# Altium schematic sheet M66_GPRS.SchDoc
size 420 x 297 mm
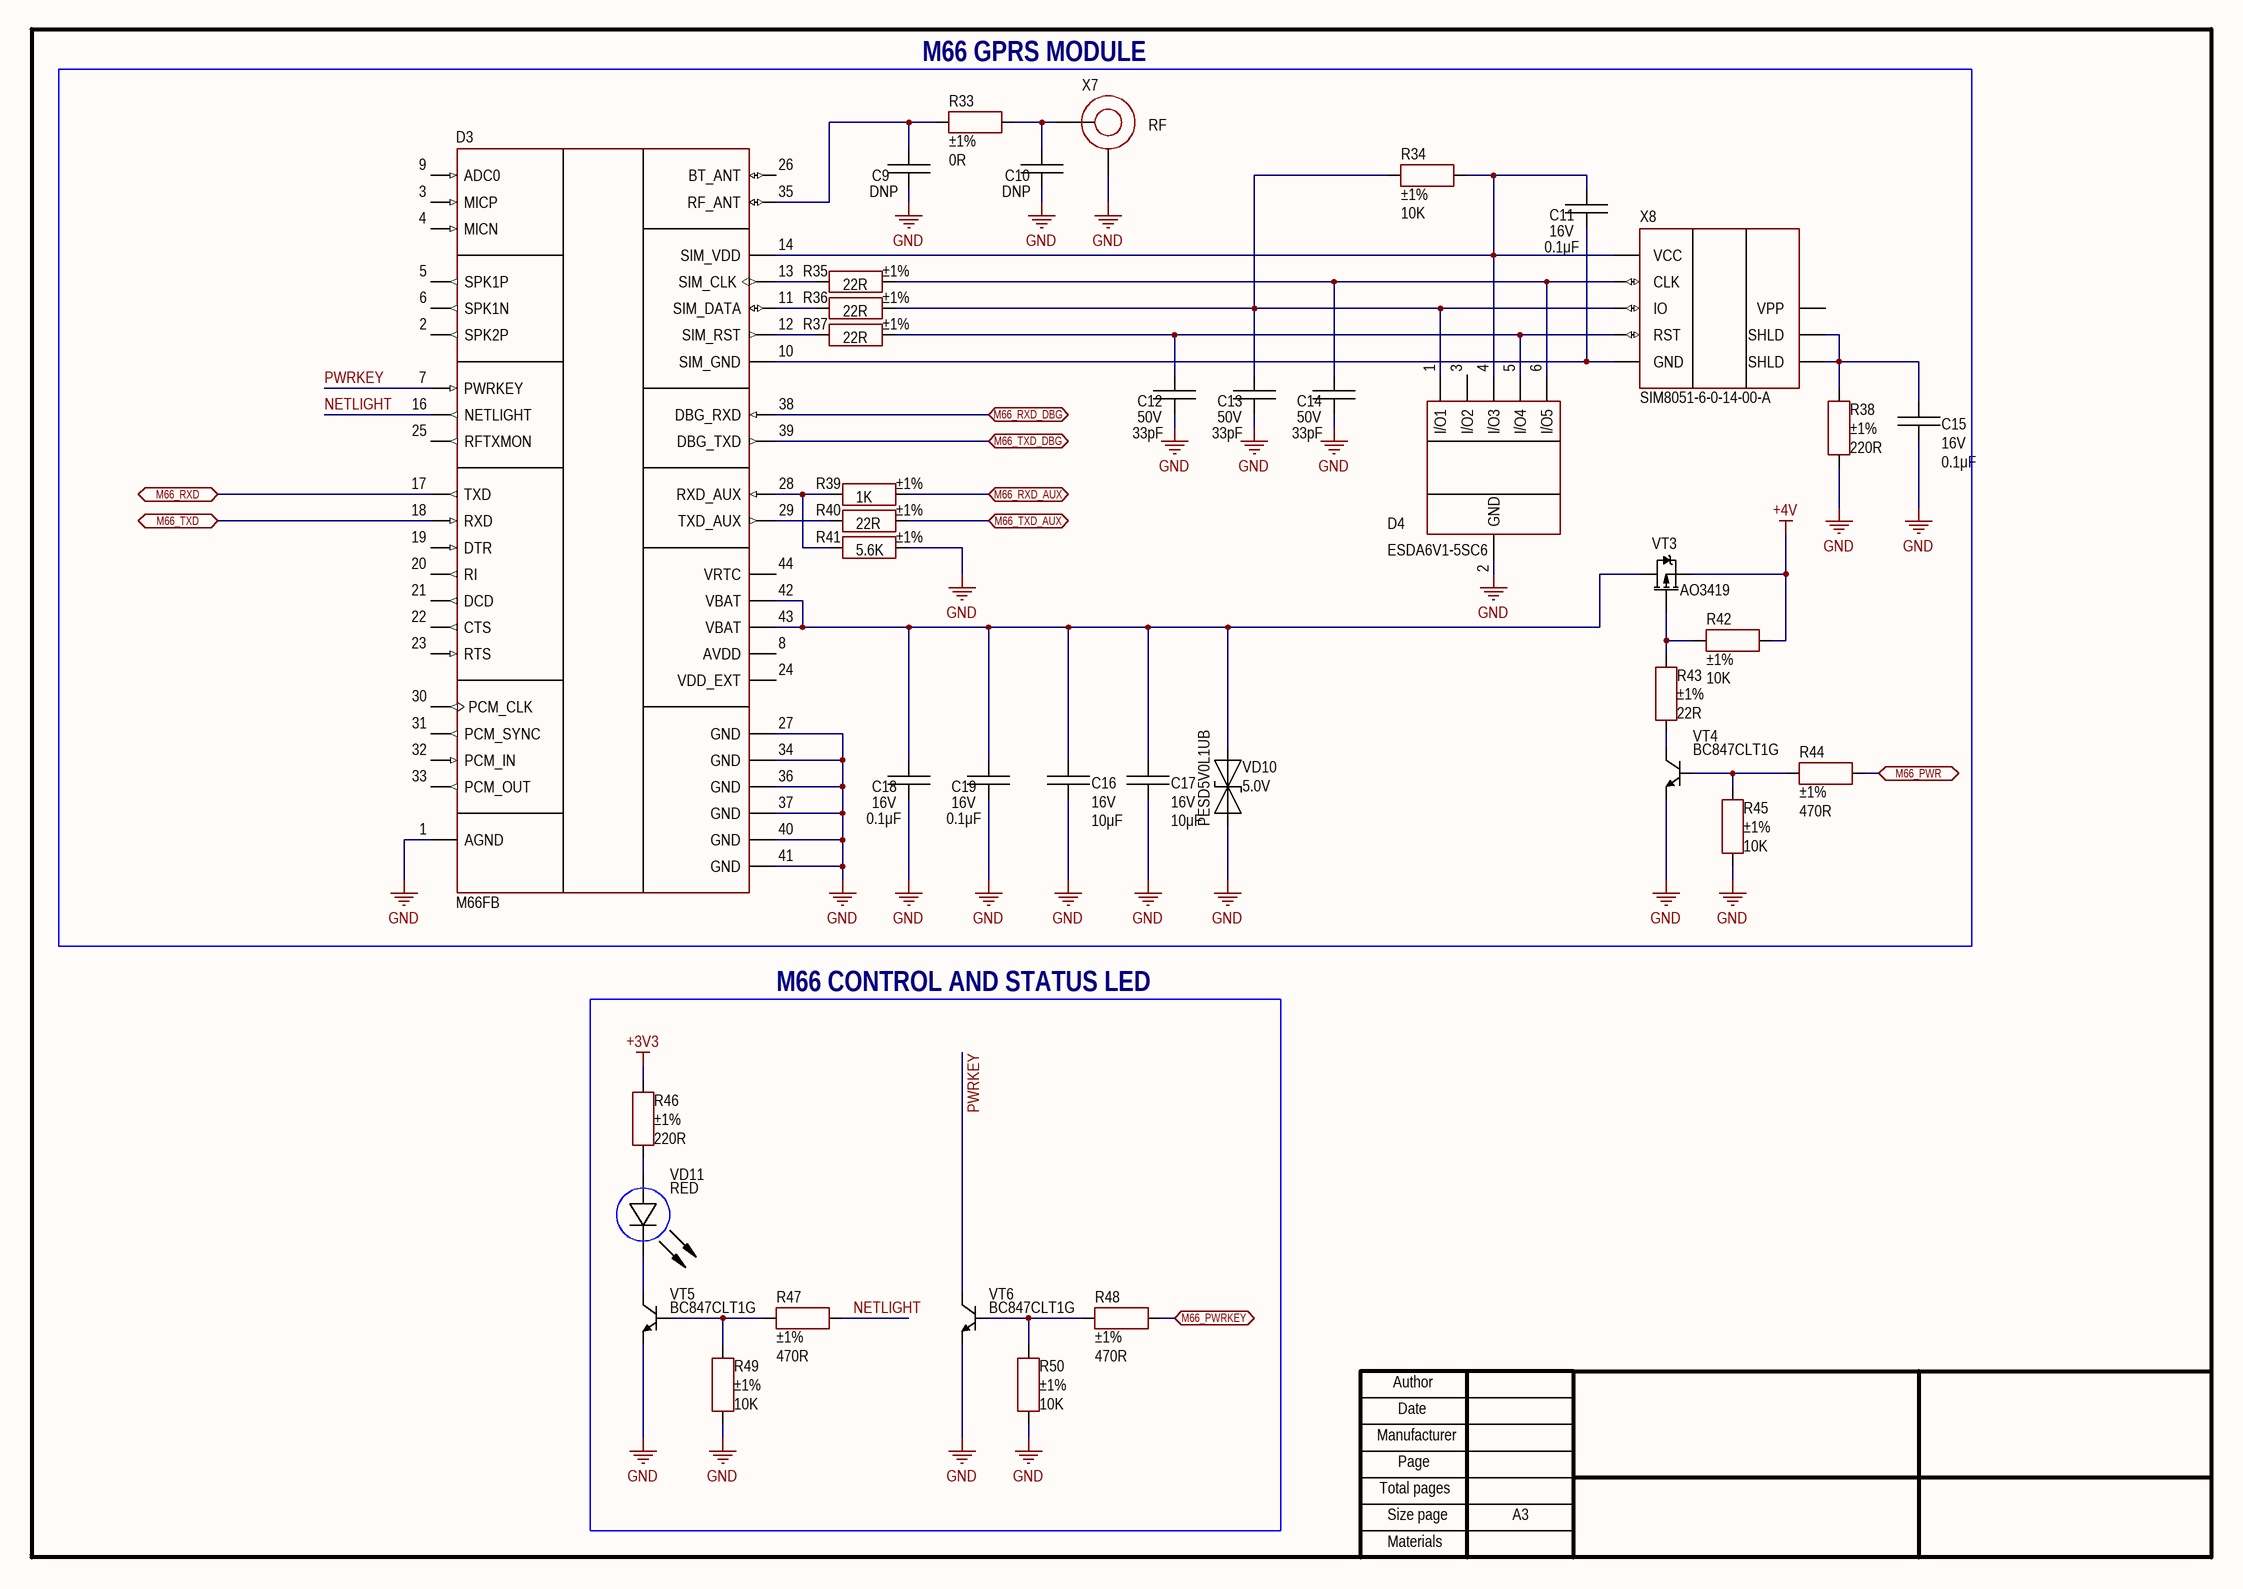
[diagram p0: M66_GPRS.SchDoc]

## Parts
C9  value DNP  [CAP: 0402]
C10  value DNP  [CAP: 0402]
C11  value 0.1μF  Voltage: 16V  [CAP: 0402]
C12  value 33pF  Voltage: 50V  [CAP: 0402]
C13  value 33pF  Voltage: 50V  [CAP: 0402]
C14  value 33pF  Voltage: 50V  [CAP: 0402]
C15  value 0.1μF  Voltage: 16V  [CAP: 0402]
C16  value 10μF  Voltage: 16V  [CAP: 0805]
C17  value 10μF  Voltage: 16V  [CAP: 0805]
C18  value 0.1μF  Voltage: 16V  [CAP: 0402]
C19  value 0.1μF  Voltage: 16V  [CAP: 0402]
D3  (no value)  [MOD: M66]
D4  (no value)  [SOT23-6]
R33  value 0R  Tolerance: ±1%  [RES: 0402]
R34  value 10K  Tolerance: ±1%  [RES: 0402]
R35  value 22R  Tolerance: ±1%  [RES: 0402]
R36  value 22R  Tolerance: ±1%  [RES: 0402]
R37  value 22R  Tolerance: ±1%  [RES: 0402]
R38  value 220R  Tolerance: ±1%  [RES: 0402]
R39  value 1K  Tolerance: ±1%  [RES: 0402]
R40  value 22R  Tolerance: ±1%  [RES: 0402]
R41  value 5.6K  Tolerance: ±1%  [RES: 0402]
R42  value 10K  Tolerance: ±1%  [RES: 0402]
R43  value 22R  Tolerance: ±1%  [RES: 0402]
R44  value 470R  Tolerance: ±1%  [RES: 0402]
R45  value 10K  Tolerance: ±1%  [RES: 0402]
R46  value 220R  Tolerance: ±1%  [RES: 0402]
R47  value 470R  Tolerance: ±1%  [RES: 0402]
R48  value 470R  Tolerance: ±1%  [RES: 0402]
R49  value 10K  Tolerance: ±1%  [RES: 0402]
R50  value 10K  Tolerance: ±1%  [RES: 0402]
VD10  Voltage: 5.0V  PartNumber: PESD5V0L1UB  [DIODE: SOD523]
VD11  Color: RED  [LED: 0805R]
VT3  PartNumber: AO3419  [SOT23]
VT4  PartNumber: BC847CLT1G  [SOT23]
VT5  PartNumber: BC847CLT1G  [SOT23]
VT6  PartNumber: BC847CLT1G  [SOT23]
X7  CommentText: RF  [CON: u.Fl]
X8  (no value)  [CON: SIM8051-6-0-14-00]

## Blocks framed on the sheet
M66 GPRS MODULE: C9-C19 D3 D4 R33-R45 VD10 VT3 VT4 X7 X8
M66 CONTROL AND STATUS LED: R46-R50 VD11 VT5 VT6

## Ports
M66_PWR (bidir), M66_PWRKEY (bidir), M66_RXD (bidir), M66_RXD_AUX (bidir), M66_RXD_DBG (bidir), M66_TXD (bidir), M66_TXD_AUX (bidir), M66_TXD_DBG (bidir)

## Nets
+3V3: R46.2
+4V: R42.1 VT3.2(S)
GND: C9.2 C10.2 C12.2 C13.2 C14.2 C15.2 C16.1 C17.1 C18.2 C19.2 D3.1(AGND) D3.27(GND) D3.34(GND) D3.36(GND) D3.37(GND) D3.40(GND) D3.41(GND) D4.2(GND) R38.1 R41.2 R45.1 R49.1 R50.1 VD10.1(A) VT4.2(E) VT5.2(E) VT6.2(E) X7.2
M66_PWR: R44.2 ; port M66_PWR
M66_PWRKEY: R48.2 ; port M66_PWRKEY
M66_RXD: D3.17(TXD) ; port M66_RXD
M66_RXD_AUX: R39.2 ; port M66_RXD_AUX
M66_RXD_DBG: D3.38(DBG_RXD) ; port M66_RXD_DBG
M66_TXD: D3.18(RXD) ; port M66_TXD
M66_TXD_AUX: R40.2 ; port M66_TXD_AUX
M66_TXD_DBG: D3.39(DBG_TXD) ; port M66_TXD_DBG
NETLIGHT: D3.16(NETLIGHT) R47.1
PWRKEY: D3.7(PWRKEY) VT6.3(C)
NetC9_1: C9.1 D3.35(RF_ANT) R33.2
NetC10_1: C10.1 R33.1 X7.1
NetC11_1: C11.1 D3.14(SIM_VDD) D4.4(I/O3) R34.1 X8.C1(VCC)
NetC11_2: C11.2 D3.10(SIM_GND) X8.C5(GND)
NetC12_1: C12.1 D4.5(I/O4) R37.2 X8.C2(RST)
NetC13_1: C13.1 D4.1(I/O1) R34.2 R36.2 X8.C7(IO)
NetC14_1: C14.1 D4.6(I/O5) R35.2 X8.C3(CLK)
NetC15_1: C15.1 R38.2 X8.C4(SHLD) X8.C8(SHLD)
NetC16_2: C16.2 C17.2 C18.1 C19.1 D3.42(VBAT) D3.43(VBAT) VD10.2(C) VT3.3(D)
NetD3_11: D3.11(SIM_DATA) R36.1
NetD3_12: D3.12(SIM_RST) R37.1
NetD3_13: D3.13(SIM_CLK) R35.1
NetD3_28: D3.28(RXD_AUX) R39.1 R41.1
NetD3_29: D3.29(TXD_AUX) R40.1
NetR42_2: R42.2 R43.2 VT3.1(G)
NetR43_1: R43.1 VT4.3(C)
NetR44_1: R44.1 R45.2 VT4.1(B)
NetR46_1: R46.1 VD11.1(A)
NetR47_2: R47.2 R49.2 VT5.1(B)
NetR48_1: R48.1 R50.2 VT6.1(B)
NetVD11_2: VD11.2(C) VT5.3(C)

Not connected (* = marked no-connect by the designer): D3 2(SPK2P) 3(MICP) 4(MICN) 5(SPK1P) 6(SPK1N) 8(AVDD) 9(ADC0) 19(DTR) 20(RI) 21(DCD) 22(CTS) 23(RTS) 24(VDD_EXT) 25(RFTXMON) 26(BT_ANT) 30(PCM_CLK) 31(PCM_SYNC) 32(PCM_IN) 33(PCM_OUT) 44(VRTC); D4 3(I/O2); X8 C6(VPP)

## Notes on the sheet
- Author
- Manufacturer
- Date
- Page
- Total pages
- Size page
- A3
- Materials

## Library data of the parts
C9 C10 = Ceramic_0402: DNP; PartNumber: DNP
C11 C15 C18 C19 = Ceramic_0402: ±10% 16V Ceramic Capacitor X7R 0402 (1005 Metric); Manufacturer: Yageo; PartNumber: CC0402KRX7R7BB104; ValueManufacturerPartNumber: Ceramic capacitor, 0.1μF, X7R, ±10%, 16V, 0402, -55...+125°C; Package: 0402; HelpURL: https://www.digikey.com/product-detail/en/yageo/CC0402KRX7R7BB104/311-1338-1-ND/2103122; Temperature: -55...+125°C; TypeCapacitor: Ceramic capacitor; Tolerance: ±10%; TypeDielectric: X7R
C12-C14 = Ceramic_0402: 33 pF ±5% 50V Ceramic Capacitor C0G, NP0 0402 (1005 Metric); Manufacturer: Yageo; PartNumber: CC0402JRNPO9BN330; ValueManufacturerPartNumber: Ceramic capacitor, 33pF, NP0, ±10%, 50V, 0402, -55...+125°C; Tolerance: ±10%; Package: 0402; HelpURL: https://www.digikey.com/en/products/detail/yageo/CC0402JRNPO9BN330/302754; Temperature: -55...+125°C; TypeCapacitor: Ceramic capacitor; TypeDielectric: NP0
C16 C17 = Ceramic_0805: ±20% 16V Ceramic Capacitor X7R 0805 (2012 Metric); Manufacturer: Yageo; PartNumber: CC0805MKX7R7BB106; ValueManufacturerPartNumber: Ceramic capacitor, 10μF, X7R, ±10%, 16V, 0805, -55...+125°C; Tolerance: ±10%; Package: 0805; HelpURL: https://www.digikey.com/en/products/detail/yageo/CC0805MKX7R7BB106/7164392; Temperature: -55...+125°C; TypeCapacitor: Ceramic capacitor; TypeDielectric: X7R
D3 = M66FB: GPRS Modem; Manufacturer: Quectel; Supply: 3.3...4.6V; Frequency: 2.4GHz; TypeProtocol: GPRS 850/ 900/ 1800/ 1900MHz + Bluetooth; HelpURL: https://www.digikey.com/en/products/detail/quectel/M66FB-03-STD/13278058; Package: 44-LGA; ComponentType: IC 2G RF transceiver; ValueManufacturerPartNumber: =ComponentType+', '+TypeProtocol+', '+Frequency+', '+CoreSize+', '+CoreProcessor+', '+MemoryROM+', '+MemoryRAM+', '+Supply+', '+Temperature+', '+Package; Temperature: -40...+85°C; PartNumber: M66FB
D4 = ESDA6V1-5SC6: 6.1V 100W TVS Array Surface Mount SOT-23-6; Manufacturer: STMicroelectronics; Current: 5A peak; Package: SOT-23-6; HelpURL: https://www.digikey.com/en/products/detail/stmicroelectronics/ESDA6V1-5SC6/1037983; ValueManufacturerPartNumber: =TypeDiode+', '+Voltage+', '+Current+', '+VoltageDrop+', '+RecoveryTime+', '+Package+', '+Temperature; Temperature: -40...+125°C; TypeDiode: TVS array; VoltageDrop: 6.1V; PartNumber: ESDA6V1-5SC6
R33 = Resistor_0402: 0 Ohms Jumper 0.063W, 1/16W Chip Resistor 0402 (1005 Metric) Moisture Resistant Thick Film; Manufacturer: Yageo; PartNumber: RC0402JR-070RL; ValueManufacturerPartNumber: Resistor film, 0R, ±1%, 0402, 0.063W, -55...+125°C; TypeResistor: Resistor film; Package: 0402; HelpURL: https://www.digikey.com/en/products/detail/yageo/RC0402JR-070RL/726406; Temperature: -55...+125°C; Power: 0.063W
R34 R42 R45 R49 R50 = Resistor_0402: 10 kOhms ±1% 0.063W, 1/16W Chip Resistor 0402 (1005 Metric) Moisture Resistant Thick Film; Manufacturer: Yageo; PartNumber: RC0402FR-0710KL; ValueManufacturerPartNumber: Resistor film, 10K, ±1%, 0402, 0.063W, -55...+125°C; TypeResistor: Resistor film; Package: 0402; HelpURL: https://www.digikey.com/en/products/detail/yageo/RC0402FR-0710KL/726523; Temperature: -55...+125°C; Power: 0.063W
R35-R37 R40 R43 = Resistor_0402: 22 Ohms ±1% 0.063W, 1/16W Chip Resistor 0402 (1005 Metric) Moisture Resistant Thick Film; Manufacturer: Yageo; PartNumber: RC0402FR-0722RL; ValueManufacturerPartNumber: Resistor film, 22R, ±1%, 0402, 0.063W, -55...+125°C; TypeResistor: Resistor film; Package: 0402; HelpURL: https://www.digikey.com/en/products/detail/yageo/RC0402FR-0722RL/726562; Temperature: -55...+125°C; Power: 0.063W
R38 R46 = Resistor_0402: 220 Ohms ±1% 0.063W, 1/16W Chip Resistor 0402 (1005 Metric) Moisture Resistant Thick Film; Manufacturer: Yageo; PartNumber: RC0402FR-07220RL; ValueManufacturerPartNumber: Resistor film, 220R, ±1%, 0402, 0.063W, -55...+125°C; TypeResistor: Resistor film; Package: 0402; HelpURL: https://www.digikey.com/en/products/detail/yageo/RC0402FR-07220RL/726565; Temperature: -55...+125°C; Power: 0.063W
R39 = Resistor_0402: 1 kOhms ±1% 0.063W, 1/16W Chip Resistor 0402 (1005 Metric) Moisture Resistant Thick Film; Manufacturer: Yageo; PartNumber: RC0402FR-071KP; ValueManufacturerPartNumber: Resistor film, 1K, ±1%, 0402, 0.063W, -55...+125°C; TypeResistor: Resistor film; Package: 0402; HelpURL: https://www.digikey.com/en/products/detail/yageo/RC0402FR-071KP/4935269; Temperature: -55...+125°C; Power: 0.063W
R41 = Resistor_0402: 5.6 kOhms ±1% 0.063W, 1/16W Chip Resistor 0402 (1005 Metric) Moisture Resistant Thick Film; Manufacturer: Yageo; PartNumber: RC0402FR-075K6L; ValueManufacturerPartNumber: Resistor film, 5.6K, ±1%, 0402, 0.063W, -55...+125°C; TypeResistor: Resistor film; Package: 0402; HelpURL: https://www.digikey.com/en/products/detail/yageo/RC0402FR-075K6L/2827590; Temperature: -55...+125°C; Power: 0.063W
R44 R47 R48 = Resistor_0402: 470 Ohms ±1% 0.063W, 1/16W Chip Resistor 0402 (1005 Metric) Moisture Resistant Thick Film; Manufacturer: Yageo; PartNumber: RC0402FR-07470RL; ValueManufacturerPartNumber: Resistor film, 470R, ±1%, 0402, 0.063W, -55...+125°C; TypeResistor: Resistor film; Package: 0402; HelpURL: https://www.digikey.com/en/products/detail/yageo/RC0402FR-07470RL/726619; Temperature: -55...+125°C; Power: 0.063W
VD10 = TVS_single: 12V Clamp 3.5A (8/20µs) Ipp Tvs Diode Surface Mount SOD-523; Manufacturer: Nexperia; TypeDiode: ESD TVS diode; Package: SOD-523; HelpURL: https://www.digikey.com/en/products/detail/nexperia-usa-inc/PESD5V0L1UB115/2092297; ValueManufacturerPartNumber: =TypeDiode+', '+Voltage+', '+Current+', '+VoltageDrop+', '+RecoveryTime+', '+Package+', '+Temperature; Temperature: -55...+150°C; Current: 3.5A
VD11 = LED_single: Red 625nm LED Indication - Discrete 1.8V 0805 (2012 Metric); Manufacturer: Kingbright; ValueManufacturerPartNumber: LED, RED, 30mA, 1.8V, 0805, -55...+150°C; PartNumber: APT2012LSECK/J3-PRV; Current: 30mA; Package: 0805; HelpURL: https://www.digikey.com/en/products/detail/kingbright/APT2012LSECK-J3-PRV/5177436; Temperature: -55...+150°C; TypeDiode: LED; VoltageDrop: 1.8V; ColorParameter: RED
VT3 = MOSFET_P_132: P-Channel 20 V 3.5A (Ta) 1.4W (Ta) Surface Mount SOT-23-3; Manufacturer: Alpha & Omega Semiconductor; ValueManufacturerPartNumber: MOSFET P-channel transistor, 20V, 3.5A, 4.4nC, 2.5W, 85mOhm, 400pF, SOT-23-3, -55...+150°C; TypeTransistor: MOSFET P-channel transistor; VoltageDS: 20V; RDS: 85mOhm; GateCharge: 4.4nC; InputCapacitor: 400pF; MaxPower: 2.5W; Package: SOT-23-3; HelpURL: https://www.digikey.com/product-detail/en/infineon-technologies/BSC340N08NS3GATMA1/BSC340N08NS3GATMA1TR-ND/2080655; Temperature: -55...+150°C; CurrentDS: 3.5A
VT4-VT6 = BJT_NPN_132: Bipolar (BJT) Transistor NPN 45 V 100 mA 100MHz 300 mW Surface Mount SOT-23-3 (TO-236); Manufacturer: ON Semiconductor; ValueManufacturerPartNumber: NPN transistor, 45V, 100mA, 100MHz, 300mW, 0.6V, 420, SOT-23, -55...+125°C; TypeTransistor: NPN transistor; VoltageCE: 45V; CurrentCE: 100mA; VoltageSaturation: 0.6V; CurrentGain: 420; MaxPower: 300mW; Package: SOT-23; HelpURL: https://www.digikey.com/product-detail/en/on-semiconductor/BC847CLT1G/BC847CLT1GOSCT-ND/917836; Temperature: -55...+125°C; Frequency: 100MHz
X7 = Connector_uFL: U.FL (UMCC), AMC Connector Jack, Male Pin 50Ohm Surface Mount Solder; Manufacturer: Amphenol RF; ValueManufacturerPartNumber: Connector u.FL, 50 Ohm, 6GHz; PartNumber: A-1JB; TypeConnector: Connector u.FL; Frequency: 6GHz; HelpURL: https://www.digikey.com/en/products/detail/amphenol-rf/A-1JB/1012540; Impedance: 50 Ohm
X8 = SIM8051-6-0-14-00-A: 6 Position Card Connector NANO SIM Surface Mount, Right Angle Gold; Manufacturer: GCT; HelpURL: https://www.digikey.com/en/products/detail/gct/SIM8051-6-0-14-00-A/10649873; ValueManufacturerPartNumber: =TypeConnector+', '+Multichannel+', '+Pitch+', '+VoltageMax+', '+CurrentMax; TypeConnector: Nano SIM; PartNumber: SIM8051-6-0-14-00-A; CommentText: SIM8051-6-0-14-00-A